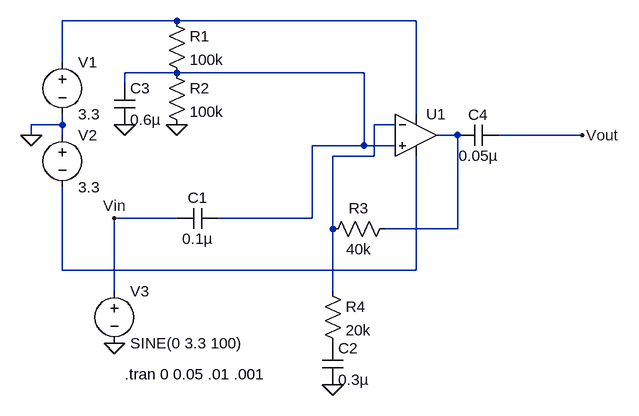
[diagram p0: schematic bipolar_to_single_ended_non_inverting2.asc]
bipolar_to_single_ended_non_inverting2.asc, the LTspice schematic file:
Version 4
SHEET 1 880 680
WIRE -96 -176 -272 -176
WIRE 272 -176 -96 -176
WIRE -272 -112 -272 -176
WIRE -96 -96 -176 -96
WIRE 192 -96 -96 -96
WIRE -176 -80 -176 -96
WIRE 272 -32 272 -176
WIRE -272 -16 -272 -32
WIRE -272 -16 -320 -16
WIRE 240 -16 208 -16
WIRE -320 0 -320 -16
WIRE -272 0 -272 -16
WIRE 336 0 304 0
WIRE 528 0 400 0
WIRE 192 16 192 -96
WIRE 192 16 112 16
WIRE 240 16 192 16
WIRE 208 32 208 -16
WIRE 208 32 144 32
WIRE -96 128 -192 128
WIRE 112 128 112 16
WIRE 112 128 -32 128
WIRE 144 144 144 32
WIRE 336 144 336 0
WIRE 336 144 224 144
WIRE -272 208 -272 80
WIRE 272 208 272 32
WIRE 272 208 -272 208
WIRE -192 240 -192 128
WIRE 144 240 144 144
FLAG -320 0 0
FLAG -96 -16 0
FLAG -176 -16 0
FLAG 144 384 0
FLAG 528 0 Vout
FLAG -192 320 0
FLAG -192 128 Vin
SYMBOL voltage -272 -128 R0
WINDOW 123 0 0 Left 0
WINDOW 39 0 0 Left 0
SYMATTR InstName V1
SYMATTR Value 3.3
SYMBOL voltage -272 -16 R0
WINDOW 123 0 0 Left 0
WINDOW 39 0 0 Left 0
SYMATTR InstName V2
SYMATTR Value 3.3
SYMBOL res -112 -192 R0
SYMATTR InstName R1
SYMATTR Value 100k
SYMBOL res -112 -112 R0
SYMATTR InstName R2
SYMATTR Value 100k
SYMBOL res 240 128 R90
WINDOW 0 0 56 VBottom 2
WINDOW 3 32 56 VTop 2
SYMATTR InstName R3
SYMATTR Value 40k
SYMBOL OpAmps\\UniversalOpAmp 272 0 R0
SYMATTR InstName U1
SYMBOL cap -32 112 R90
WINDOW 0 0 32 VBottom 2
WINDOW 3 32 32 VTop 2
SYMATTR InstName C1
SYMATTR Value 0.1µ
SYMBOL res 128 224 R0
SYMATTR InstName R4
SYMATTR Value 20k
SYMBOL cap 128 320 R0
SYMATTR InstName C2
SYMATTR Value 0.3µ
SYMBOL cap -192 -80 R0
SYMATTR InstName C3
SYMATTR Value 0.6µ
SYMBOL cap 400 -16 R90
WINDOW 0 0 32 VBottom 2
WINDOW 3 32 32 VTop 2
SYMATTR InstName C4
SYMATTR Value 0.05µ
SYMBOL voltage -192 224 R0
WINDOW 123 0 0 Left 0
WINDOW 39 0 0 Left 0
SYMATTR InstName V3
SYMATTR Value SINE(0 3.3 100)
TEXT -176 368 Left 2 !.tran 0 0.05 .01 .001

The netlist it stands for:
* bipolar_to_single_ended_non_inverting2.asc
V1 N001 0 3.3
V2 0 N005 3.3
R1 N001 N002 100k
R2 N002 0 100k
R3 N004 N003 40k
XU1 N002 N003 N001 N005 N004 level1 Avol=1Meg GBW=10Meg Vos=0 En=0 Enk=0 In=0 Ink=0 Rin=500Meg  ; pins In+ In- V+ V- OUT
C1 N002 Vin 0.1µ
R4 N003 P001 20k
C2 P001 0 0.3µ
C3 N002 0 0.6µ
C4 Vout N004 0.05µ
V3 Vin 0 SINE(0 3.3 100)
.tran 0 0.05 .01 .001
.lib UniversalOpAmp1.lib
.backanno
.end